# Altium schematic sheet Relai.SchDoc
size A4
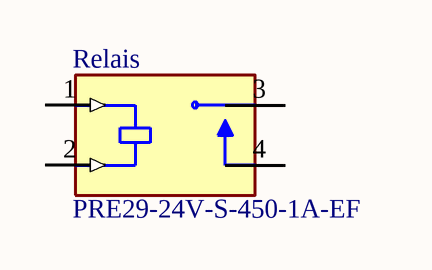
[diagram p0: Relai.SchDoc]

## Parts
Relais  PRE29-24V-S-450-1A-EF  [RELAY_PRE29-24V-S-450-1A-EF]

## Nets

Not connected (* = marked no-connect by the designer): Relais 1(COIL1) 2(COIL2) 3(COM) 4(NO)

## Library data of the parts
Relais = PRE29-24V-S-450-1A-EF: General Purpose Relay SPST-NO (1 Form A) 24VDC Coil Through Hole; MF: CUI DEVICES; SnapEDA_Link: https://www.snapeda.com/parts/PRE29-24V-S-450-1A-EF/Same+Sky/view-part/?ref=snap; Package: Package; Value: *; MP: PRE29-24V-S-450-1A-EF; Check_prices: https://www.snapeda.com/parts/PRE29-24V-S-450-1A-EF/Same+Sky/view-part/?ref=eda